# Altium schematic sheet Headers.SchDoc
size A4
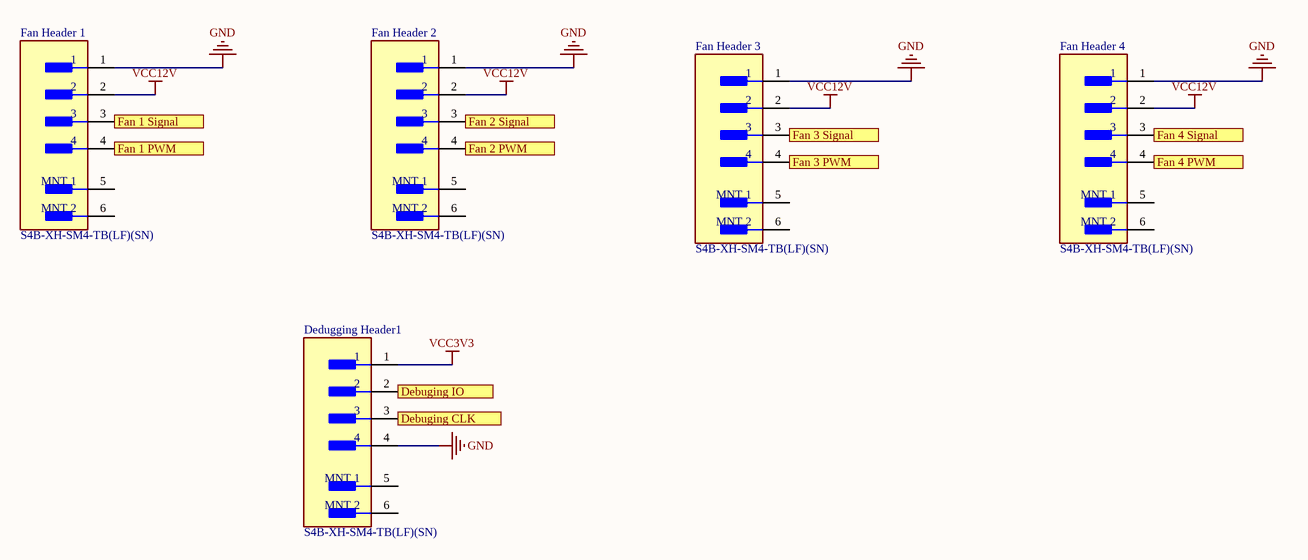
[diagram p0: Headers.SchDoc]

## Parts
Dedugging_Header1  S4B-XH-SM4-TB(LF)(SN)  [FP-S4B-XH-SM4-TB_LF_SN-MFG]
Fan_Header_1  S4B-XH-SM4-TB(LF)(SN)  [FP-S4B-XH-SM4-TB_LF_SN-MFG]
Fan_Header_2  S4B-XH-SM4-TB(LF)(SN)  [FP-S4B-XH-SM4-TB_LF_SN-MFG]
Fan_Header_3  S4B-XH-SM4-TB(LF)(SN)  [FP-S4B-XH-SM4-TB_LF_SN-MFG]
Fan_Header_4  S4B-XH-SM4-TB(LF)(SN)  [FP-S4B-XH-SM4-TB_LF_SN-MFG]

## Ports
Debuging CLK, Debuging IO, Fan 1 PWM, Fan 1 Signal, Fan 2 PWM, Fan 2 Signal (out), Fan 3 PWM, Fan 3 Signal, Fan 4 PWM, Fan 4 Signal

## Nets
GND: Dedugging_Header1.4 Fan_Header_1.1 Fan_Header_2.1 Fan_Header_3.1 Fan_Header_4.1
VCC3V3: Dedugging_Header1.1
VCC12V: Fan_Header_1.2 Fan_Header_2.2 Fan_Header_3.2 Fan_Header_4.2
Debuging CLK: Dedugging_Header1.3 ; port Debuging CLK
Debuging IO: Dedugging_Header1.2 ; port Debuging IO
Fan 1 PWM: Fan_Header_1.4 ; port Fan 1 PWM
Fan 1 Signal: Fan_Header_1.3 ; port Fan 1 Signal
Fan 2 PWM: Fan_Header_2.4 ; port Fan 2 PWM
Fan 2 Signal: Fan_Header_2.3 ; port Fan 2 Signal
Fan 3 PWM: Fan_Header_3.4 ; port Fan 3 PWM
Fan 3 Signal: Fan_Header_3.3 ; port Fan 3 Signal
Fan 4 PWM: Fan_Header_4.4 ; port Fan 4 PWM
Fan 4 Signal: Fan_Header_4.3 ; port Fan 4 Signal

Not connected (* = marked no-connect by the designer): Dedugging_Header1 5(MNT_1) 6(MNT_2); Fan_Header_1 5(MNT_1) 6(MNT_2); Fan_Header_2 5(MNT_1) 6(MNT_2); Fan_Header_3 5(MNT_1) 6(MNT_2); Fan_Header_4 5(MNT_1) 6(MNT_2)

## Library data of the parts
Dedugging_Header1 Fan_Header_1-Fan_Header_4 = CMP-17439-000072-1: CONN HEADER SMD R/A 4POS 2.5MM; Number of Positions: 4; Max Current Rating: 3A; Max Voltage Rating (AC): 250V; Connector Type: Male Pin; Contact Resistance: 20mR; Gender: Male; Pitch: 0.098inch; Max Operating Temperature: 85°C; Contact Plating: Tin; Housing Material: Polyamide; Housing Color: Beige; Depth: 10mm; Series: XH; Package Quantity: 1; Length: 15mm; Contact Material: Copper Alloy; Min Operating Temperature: -25°C; REACH SVHC: No SVHC; Orientation: Right Angle; Number of Rows: 1; Contact Type: Male Pin; Color: Natural; Lead Free: Lead Free; Termination: Solder; Mount: Surface Mount; Number of Contacts: 4; Packaging: Tape and Reel